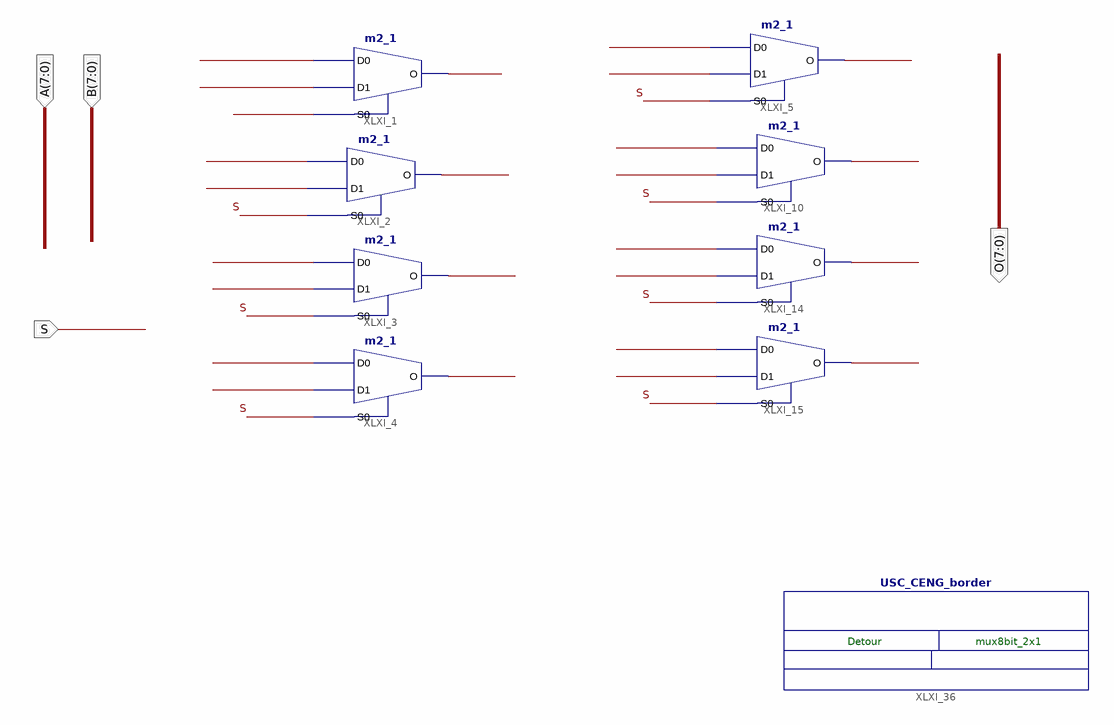
[diagram p0: schematic sheet 1]
// Xilinx ISE schematic mux8bit_2x1.sch (spartan6) as structural Verilog: 9 symbols, 4 ports
module mux8bit_2x1 (
  input  S,
  input  [7:0] A,
  input  [7:0] B,
  output [7:0] O
);

  m2_1 XLXI_1 (.D0(A[0]), .D1(B[0]), .S0(S), .O(O[0]));
  m2_1 XLXI_2 (.D0(A[1]), .D1(B[1]), .S0(S), .O(O[1]));
  m2_1 XLXI_3 (.D0(A[2]), .D1(B[2]), .S0(S), .O(O[2]));
  m2_1 XLXI_4 (.D0(A[3]), .D1(B[3]), .S0(S), .O(O[3]));
  m2_1 XLXI_5 (.D0(A[4]), .D1(B[4]), .S0(S), .O(O[4]));
  m2_1 XLXI_10 (.D0(A[5]), .D1(B[5]), .S0(S), .O(O[5]));
  m2_1 XLXI_14 (.D0(A[6]), .D1(B[6]), .S0(S), .O(O[6]));
  m2_1 XLXI_15 (.D0(A[7]), .D1(B[7]), .S0(S), .O(O[7]));
  USC_CENG_border XLXI_36 ();

  // Notes on the sheet:
  //   Detour
  //   mux8bit_2x1
endmodule
